# EAGLE schematic 2013-09-22-Start (EAGLE 6.5.0)
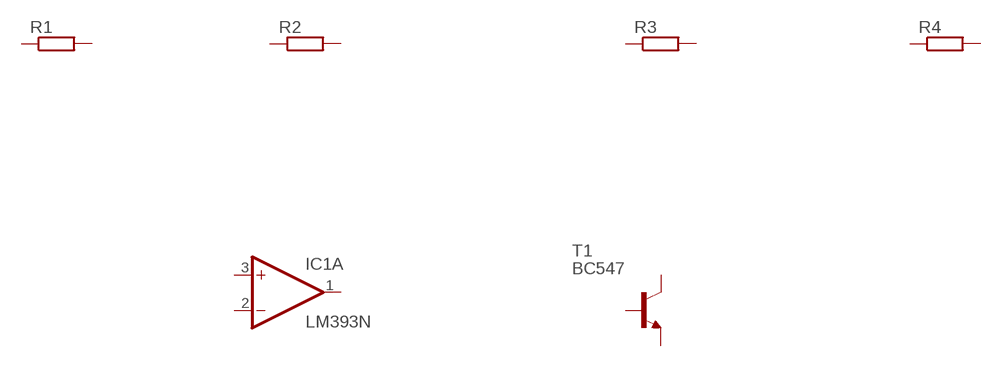
[diagram p0: schematic, sheet 1]

## Parts
IC1  LM393N  [DIL08]
R1  R-EU_0207/7  [0207/7]
R2  R-EU_0207/7  [0207/7]
R3  R-EU_0207/7  [0207/7]
R4  R-EU_0207/7  [0207/7]
T1  BC547  [TO92]
Unconnected: IC1.1(A:OUT) IC1.2(A:-IN) IC1.3(A:+IN) IC1.5(B:+IN) IC1.6(B:-IN) IC1.7(B:OUT) R1.1 R1.2 R2.1 R2.2 R3.1 R3.2 R4.1 R4.2 T1.1(E) T1.2(B) T1.3(C)

## Power pins joined to a net without a drawn wire
V+: IC1.8(P:V+)
V-: IC1.4(P:V-)

## Library data of the parts
IC1 = linear:LM393: COMPARATOR
R1-R4 = rcl:R-EU_: RESISTOR, European symbol
T1 = transistor-neu-to92:BC547: NPN TRANSISTOR